# Altium project STM32_Hat.PrjPcb
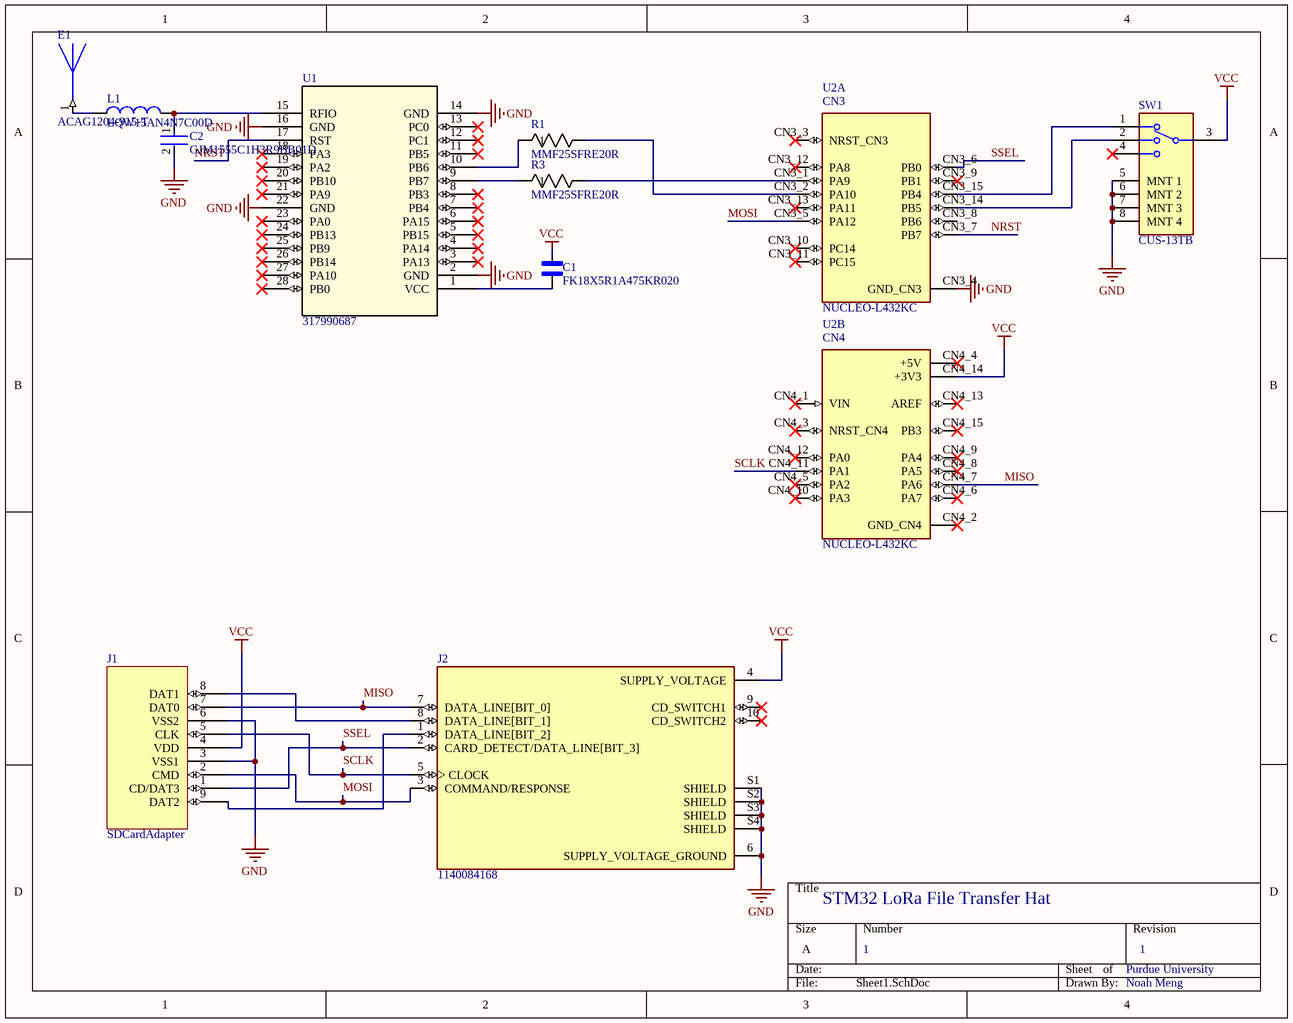
[diagram p0: Sheet1.SchDoc]
1 sheet, 11 parts. Net scope: global (net labels, ports and power ports of the same name join across sheets).
Board file: PCB1.PcbDoc

## Sheet Sheet1.SchDoc: STM32 LoRa File Transfer Hat
size A; Author: Noah Meng; DrawnBy: Noah Meng; Organization: Purdue University; Revision: 1; SheetNumber: 1; SheetTotal: 1

### Parts
C1  FK18X5R1A475KR020  [CAPRB250W50L400T250H550]
C2  GJM1555C1H3R9BB01D  [FP-GJM155-0_05-IPC_A]
E1  ACAG1204-915-T  [XDCR_ACAG1204-915-T]
J1  SDCardAdapter  [SD Card Adapter]
J2  1140084168  [AMPHENOL_1140084168]
L1  LQW15AN4N7C00D  [INDC1006X60N]
R1  MMF25SFRE20R  [RES_MMF25S_3P5X1P4_YAG]
R3  MMF25SFRE20R  [RES_MMF25S_3P5X1P4_YAG]
SW1  CUS-13TB  [FP-CUS-13TB-MFG]
U1  317990687  [QFN_90687_SEE-M]
U2  NUCLEO-L432KC  [MODULE_NUCLEO-L432KC]  (parts A,B of 2)

### Nets
GND: C2.2 J1.3(VSS1) J1.6(VSS2) J2.6(SUPPLY_VOLTAGE_GROUND) J2.S1(SHIELD) J2.S2(SHIELD) J2.S3(SHIELD) J2.S4(SHIELD) SW1.5(MNT_1) SW1.6(MNT_2) SW1.7(MNT_3) SW1.8(MNT_4) U1.2(GND) U1.14(GND) U1.16(GND) U1.22(GND) U2.CN3_4(GND_CN3)
VCC: C1.2 J1.4(VDD) J2.4(SUPPLY_VOLTAGE) SW1.3(C) U2.CN4_14(+3V3)
MISO: J1.7(DAT0) J2.7(DATA_LINE[BIT_0]) U2.CN4_7(PA6)
MOSI: J1.2(CMD) J2.3(COMMAND/RESPONSE) U2.CN3_5(PA12)
NRST: U1.17(RST) U2.CN3_7(PB7)
SCLK: J1.5(CLK) J2.5(CLOCK) U2.CN4_11(PA1)
SSEL: J1.1(CD/DAT3) J2.2(CARD_DETECT/DATA_LINE[BIT_3]) U2.CN3_6(PB0)
NetC1_1: C1.1 U1.1(VCC)
NetC2_1: C2.1 L1.2 U1.15(RFIO)
NetE1_1: E1.1 L1.1
NetJ1_8: J1.8(DAT1) J2.8(DATA_LINE[BIT_1])
NetJ1_9: J1.9(DAT2) J2.1(DATA_LINE[BIT_2])
NetR1_1: R1.1 U1.10(PB6)
NetR1_2: R1.2 U2.CN3_2(PA10)
NetR3_1: R3.1 U1.9(PB7)
NetR3_2: R3.2 U2.CN3_1(PA9)
NetSW1_1: SW1.1 U2.CN3_15(PB4)
NetSW1_2: SW1.2 U2.CN3_14(PB5)

Not connected (* = marked no-connect by the designer): J2 9(CD_SWITCH1)* 10(CD_SWITCH2)*; SW1 4*; U1 3(PA13)* 4(PA14)* 5(PB15)* 6(PA15)* 7(PB4)* 8(PB3)* 11(PB5)* 12(PC1)* 13(PC0)* 18(PA3)* 19(PA2)* 20(PB10)* 21(PA9)* 23(PA0)* 24(PB13)* 25(PB9)* 26(PB14)* 27(PA10)* 28(PB0)*; U2 CN3_3(NRST_CN3)* CN3_8(PB6) CN3_9(PB1)* CN3_10(PC14)* CN3_11(PC15)* CN3_12(PA8)* CN3_13(PA11)* CN4_1(VIN)* CN4_2(GND_CN4)* CN4_3(NRST_CN4)* CN4_4(+5V)* CN4_5(PA2)* CN4_6(PA7)* CN4_8(PA5)* CN4_9(PA4)* CN4_10(PA3)* CN4_12(PA0)* CN4_13(AREF)* CN4_15(PB3)*

### Notes on the sheet
- (in symbol NUCLEO-L432KC, part A) CN3
- (in symbol NUCLEO-L432KC, part B) CN4

### Library data of the parts
C1 = FK18X5R1A475KR020: MF: {'manufacturer': u'TDK Corporation'}; Package: None; Price: None; Value: *; MP: FK18X5R1A475KR020; Availability: Unavailable
C2 = CMP-2008-03852-2: Multi-Layer Ceramic Capacitor 3.9pF C0G  ±0.1pF 0402 Paper T/R; Voltage Rating: 50V; Max Operating Temperature: 125°C; Case Code (Imperial): 0402; Packaging: Tape and Reel; Package Quantity: 10000; Voltage Rating (DC): 50V; Thickness: 0.022inch; Case/Package: 0402; Lead Pitch: 0.3mm; Min Operating Temperature: -55°C; Capacitance: 3.9pF; Case Code (Metric): 1005; Width: 0.02inch; Termination: SMD/SMT; Length: 1mm; Mount: Surface Mount; Height: 0.5mm; Depth: 0.5mm; Dielectric: C0G; REACH SVHC: No SVHC; Number of Pins: 2; Radiation Hardening: No
E1 = ACAG1204-915-T: 915MHz ISM, LoRa, Sigfox Chip RF Antenna 910MHz ~ 925MHz 3.42dBi Solder Surface Mount; MF: Abracon LLC; Check_prices: https://www.snapeda.com/parts/ACAG1204-915-T/Abracon+LLC/view-part/?ref=eda; Purchase-URL: https://pricing.snapeda.com/search/part/ACAG1204-915-T/?ref=eda; Value: *; Availability: In Stock; Package: None; SnapEDA_Link: https://www.snapeda.com/parts/ACAG1204-915-T/Abracon+LLC/view-part/?ref=snap; MP: ACAG1204-915-T; Price: None
J1 = SDCardAdapter: SD card adapter
J2 = 1140084168: 10 (8 + 2) Position Card Connector Secure Digital - microSDâ„¢ Surface Mount, Right Angle Gold; MF: Amphenol ICC; Check_prices: https://www.snapeda.com/parts/1140084168/Amphenol+FCI/view-part/?ref=eda; Value: *; Availability: In Stock; MP: 1140084168; Price: None; Package: None; SnapEDA_Link: https://www.snapeda.com/parts/1140084168/Amphenol+FCI/view-part/?ref=snap; Purchase-URL: https://pricing.snapeda.com/search/part/1140084168/?ref=eda
L1 = LQW15AN4N7C00D: INDUCTOR, 0402, 4.7NH; Inductor Type:Chip Coils; Inductance Tolerance:Â± 0.2nH; Resistance:0.07ohm; DC Current Max:750mA; Case Style:0402; Q Factor @ Vr, F:25; Core Material:Alumina; External Depth:0.6mm; External Length / ;RoHS Compliant: Yes; Package: None; Price: None; Value: *; MP: LQW15AN4N7C00D; Availability: Unavailable
R1 R3 = MMF25SFRE20R: No Description Available; Mfr_Name: Yageo
SW1 = CMP-71745-000014-2: SWITCH SLIDE SP3T 300MA 4V; NexarPartId: 85266946; Contact Current Rating: 100mA; Contact Style: Non-Shorting; Life (Cycles): 10kcycles; Max Voltage Rating (DC): 20V; Number of Positions: 3; Contact Resistance: 70mΩ; Switch Function: On-On-On; Actuator Material: Nylon, Polyamide; Switch Travel: 1.5mm; Operating Force: 1.7N; Voltage Rating (DC): 4V; Throw Configuration: SP3T; Height: 1.6mm; Electrical Life: 10kcycles; Min Operating Temperature: -20°C; RoHS: Compliant; Mount: Surface Mount; Radiation Hardening: No; Contact Plating: Gold; Termination: Gull Wing; Orientation: Right Angle; Current Rating: 300mA; Actuator Length: 1.5mm; Max Operating Temperature: 70°C; Packaging: Tape & Reel (TR)
U1 = 317990687: No Description Available; Mfr_Name: BeagleBoard; RefDes: RefDes; Type: Type
U2 = NUCLEO-L432KC: STM32L432KC, mbed-Enabled Development Nucleo-32 STM32L4 ARMÂ® CortexÂ®-M4 MCU 32-Bit Embedded Evaluation Board; MF: STMicroelectronics; SnapEDA_Link: https://www.snapeda.com/parts/NUCLEO-L432KC/STMicroelectronics/view-part/?ref=snap; Package: None; Value: *; MP: NUCLEO-L432KC; Check_prices: https://www.snapeda.com/parts/NUCLEO-L432KC/STMicroelectronics/view-part/?ref=eda